# Altium schematic sheet tcan1051.SchDoc
size A4; SheetNumber: 1; SheetTotal: 1
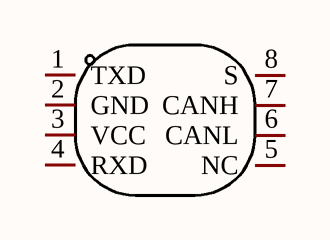
[diagram p0: tcan1051.SchDoc]

## Parts
?  TCAN1051DRQ1  [PCBComponent_1 - duplicate]  (value not drawn)

## Nets

Not connected (* = marked no-connect by the designer): ? 1(TXD) 2(GND) 3(VCC) 4(RXD) 5(NC) 6(CANL) 7(CANH) 8(S)

## Library data of the parts
? = TCAN1051DRQ1: Manufacturer: TI(德州仪器); Add into BOM: yes; Symbol: TCAN1051DRQ1; Device: TCAN1051DRQ1; LCSC Part Name: TCAN1051DRQ1; Supplier Part: C2671229; Manufacturer Part: TCAN1051DRQ1; Supplier Footprint: SOIC-8; JLCPCB Part Class: Extended Part; Supplier: LCSC; Convert to PCB: yes